# EAGLE schematic modified (EAGLE 7.7.0)
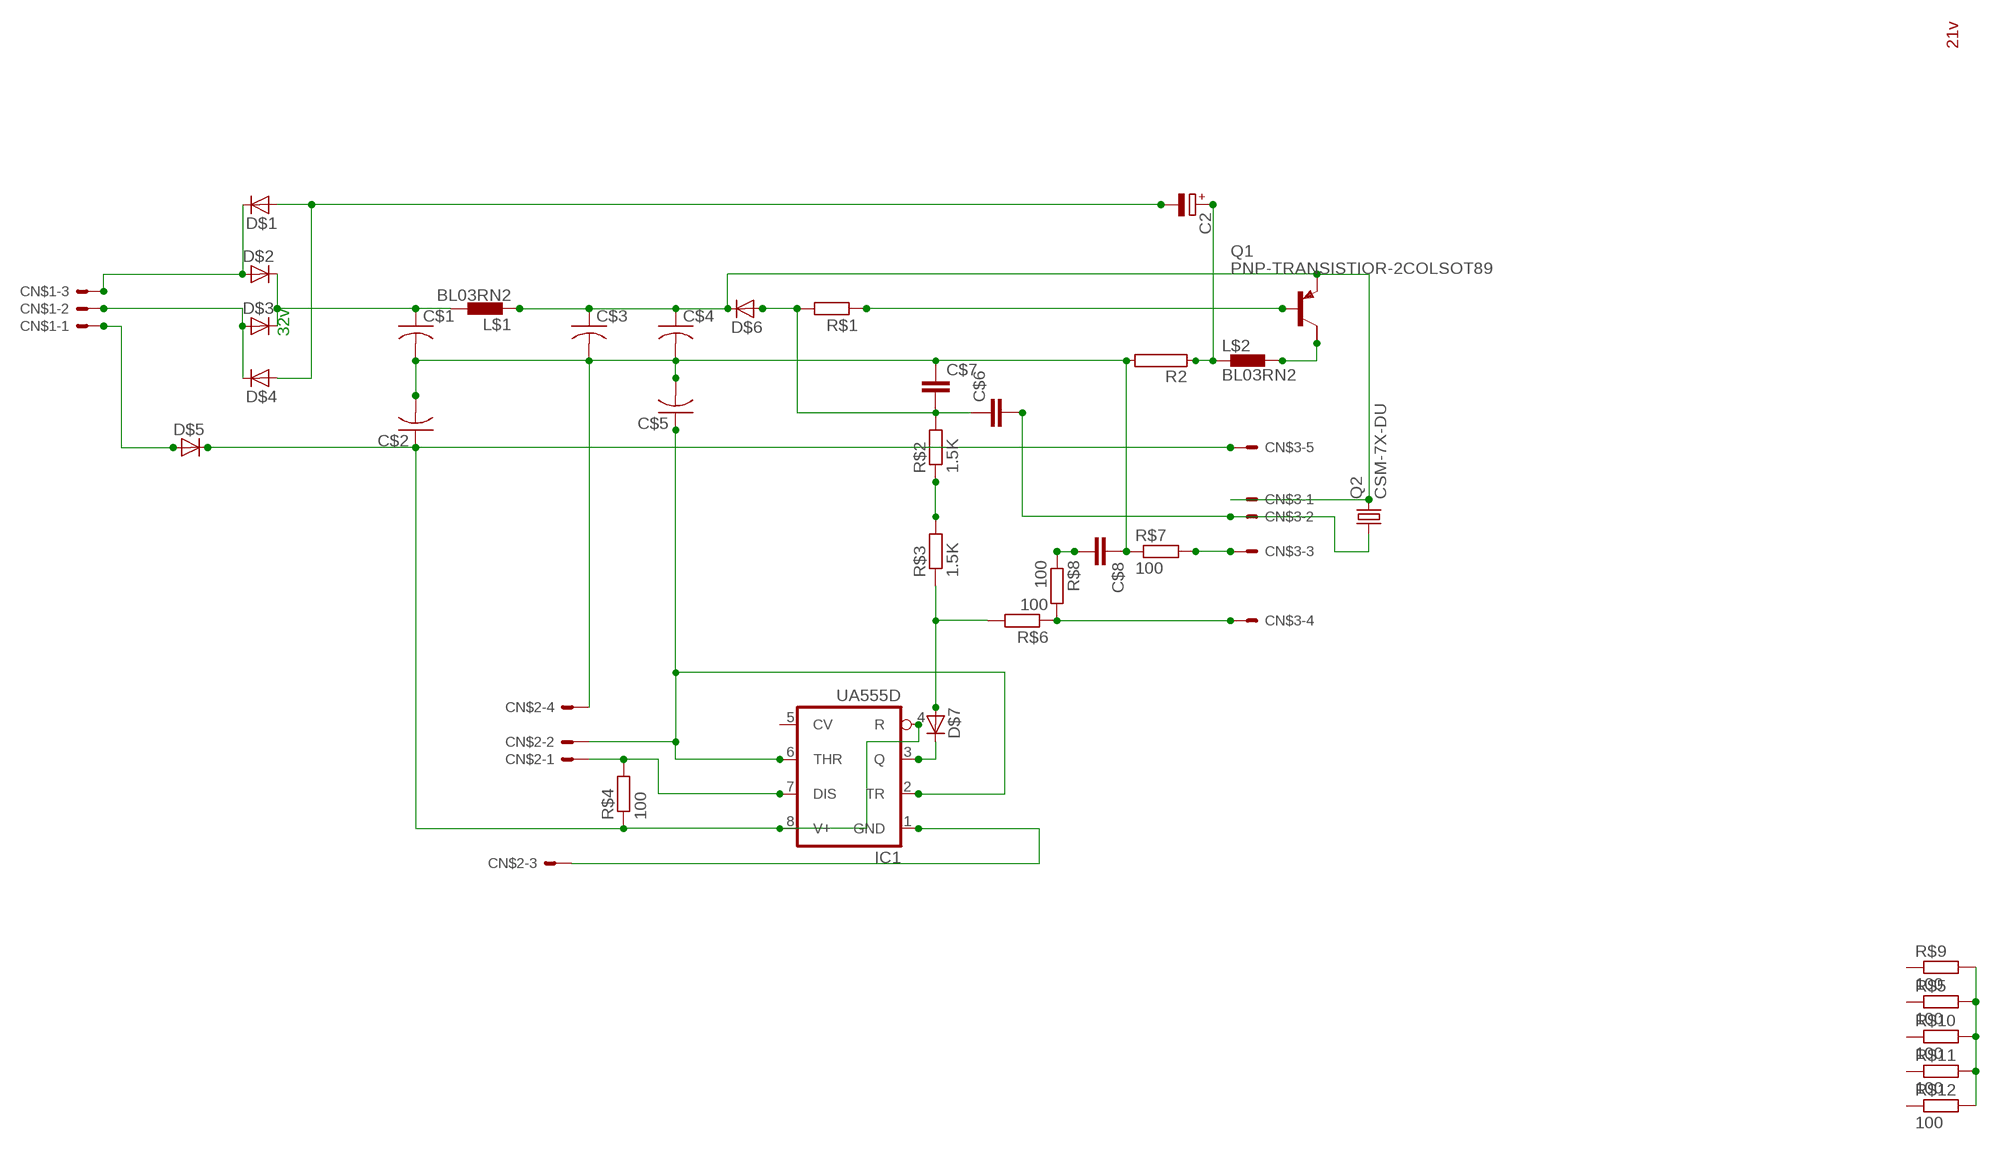
[diagram p0: schematic, sheet 1]

## Parts
C2  CPOL-EUSANYO_H  [SANYO-OSCON_H]
C$1  C-US050-075X075  [C050-075X075]
C$2  C-US050-075X075  [C050-075X075]
C$3  C-US025-050X050  [C025-050X050]
C$4  C-US025-050X050  [C025-050X050]
C$5  C-US025-050X050  [C025-050X050]
C$6  C7.5/3  [C7.5B3]
C$7  C7.5/3  [C7.5B3]
C$8  C2.5/5  [C2.5-5]
CN$1  KK-156-3  [KK-156-3]
CN$2  KK-156-4  [KK-156-4]
CN$3  KK-156-5  [KK-156-5]
D$1  D-SOD-87  [SOD87]
D$2  D-SOD-87  [SOD87]
D$3  D-SOD-87  [SOD87]
D$4  D-SOD-87  [SOD87]
D$5  D-SOD-87  [SOD87]
D$6  D-SOD-87  [SOD87]
D$7  D-SOD-87  [SOD87]
IC1  UA555D  [SO08]
L$1  BL03RN2  [BL03RN2]
L$2  BL03RN2  [BL03RN2]
Q1  PNP-TRANSISTIOR-2COLSOT89  [SOT89]
Q2  CSM-7X-DU  [CSM-7X-DU]
R2  RAC01  [AC01]
R$1  R-EU_R0603  [R0603]
R$2  1.5K  R-EU_R0603  [R0603]
R$3  1.5K  R-EU_R0603  [R0603]
R$4  100  R-EU_R0603  [R0603]
R$5  100  R-EU_R0603  [R0603]
R$6  100  R-EU_R0603  [R0603]
R$7  100  R-EU_R0603  [R0603]
R$8  100  R-EU_R0603  [R0603]
R$9  100  R-EU_R0603  [R0603]
R$10  100  R-EU_R0603  [R0603]
R$11  100  R-EU_R0603  [R0603]
R$12  100  R-EU_R0603  [R0603]

## Nets
N$1: C$3.1 C$4.1 CN$3.1 D$6.1(C) L$1.1 Q1.3(E) Q2.2
N$2: CN$1.2 D$3.2(A) D$4.1(C)
N$6: CN$1.3 D$1.1(C) D$2.2(A)
N$7: C2.- D$1.2(A) D$4.2(A)
N$9: CN$1.1 D$5.2(A)
N$12: C$1.2 C$2.2 C$3.2 C$4.2 C$5.2 C$7.1 C$8.1 CN$2.4 R2.2 R$7.1
N$13: R$2.1 R$3.2
N$14: D$7.2(A) R$3.1 R$6.2
N$15: D$7.1(C) IC1.3(Q)
N$16: CN$3.4 R$6.1 R$8.2
N$17: C$8.2 R$8.1
N$19: C$5.1 CN$2.2 IC1.2(TR) IC1.6(THR)
N$20: CN$3.3 R$7.2
N$21: L$2.2 Q1.2(C)
N$22: C2.+ L$2.1 R2.1
N$23: R$5.2 R$9.2 R$10.2 R$11.2 R$12.2
N$24: C$6.2 CN$3.2 Q2.1
N$26: C$6.1 C$7.2 D$6.2(A) R$1.2 R$2.2
N$27: C$1.1 D$2.1(C) D$3.1(C) L$1.2
N$28: C$2.1 CN$3.5 D$5.1(C) IC1.4(R) IC1.8(V+) R$4.1
N$33: Q1.1(B) R$1.1
N$35: CN$2.1 IC1.7(DIS) R$4.2
N$37: CN$2.3 IC1.1(GND)
Unconnected: IC1.5(CV) Q1.2@1(C/) R$5.1 R$9.1 R$10.1 R$11.1 R$12.1

## Notes on the sheet
- 21v
- 32v

## Library data of the parts
C2 = rcl:CPOL-EU: POLARIZED CAPACITOR, European symbol
C$1-C$5 = resistor:C-US: CAPACITOR, American symbol
C$6-C$8 = capacitor-wima:C: CAPACITOR naming: grid - package width
CN$1 = con-molex:KK-156-3: KK 156 HEADER Source: http://www.molex.com/pdm_docs/sd/026604100_sd.pdf; OC_FARNELL: unknown; OC_NEWARK: unknown
CN$2 = con-molex:KK-156-4: KK 156 HEADER Source: http://www.molex.com/pdm_docs/sd/026604100_sd.pdf; OC_FARNELL: unknown; OC_NEWARK: unknown
CN$3 = con-molex:KK-156-5: KK 156 HEADER Source: http://www.molex.com/pdm_docs/sd/026604100_sd.pdf; OC_FARNELL: unknown; OC_NEWARK: unknown
D$1-D$7 = semicon-smd-ipc:D-: DIODE unfilled
IC1 = linear:*555: TIMER
L$1 L$2 = inductors:BL0: Noise Suppression Products/EMI Suppression Filters, Lead EMIFIL(R) Inductor Type Source: http://www.murata.com .. BL01RN1_DS.pdf
Q1 = semicon-smd-ipc:PNP-TRANSISTIOR-2COL: PNP TRANSISTOR 2 colletor pins
Q2 = crystal:CSM-7X-DU: SMD CRYSTAL Source: www.ecsxtal.com .. Crystal 3.6864MHz CSM_7X_DU.PDF; OC_FARNELL: unknown; OC_NEWARK: unknown
R2 = resistor-power:R: Power Resitor; OC_FARNELL: unknown; OC_NEWARK: unknown
R$1-R$12 = rcl:R-EU_: RESISTOR, European symbol